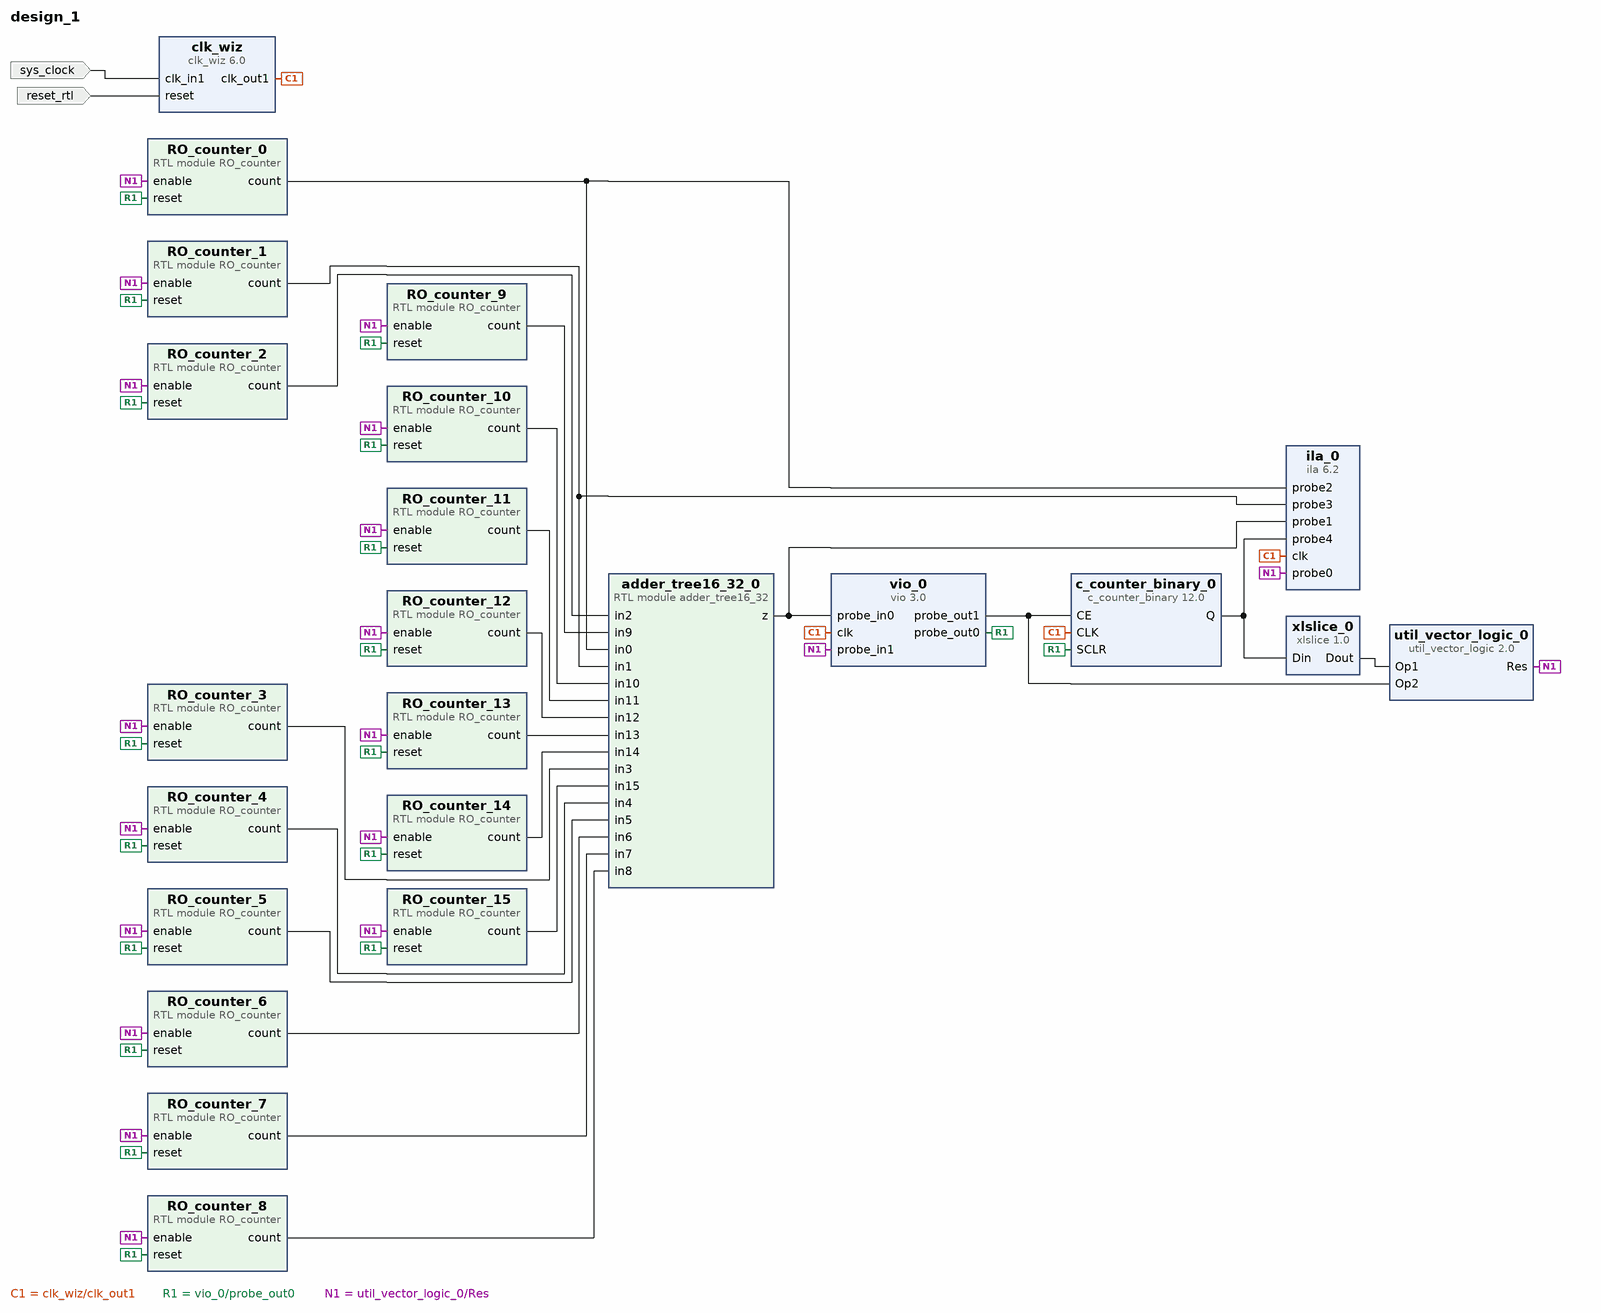
[diagram p0: block diagram of the top level]
# Vivado block design design_1, xc7z010clg400-1, Vivado 2020.1
create_bd_design design_1

create_bd_port -dir I -type clk sys_clock
set_property -dict {CONFIG.FREQ_HZ 125000000 CONFIG.PHASE 0.000} [get_bd_ports sys_clock]
create_bd_port -dir I -type rst reset_rtl
set_property -dict {CONFIG.POLARITY ACTIVE_HIGH} [get_bd_ports reset_rtl]

create_bd_cell -type ip -vlnv xilinx.com:ip:vio:3.0 vio_0
set_property -dict {CONFIG.C_NUM_PROBE_IN 2 CONFIG.C_NUM_PROBE_OUT 2} [get_bd_cells vio_0]
create_bd_cell -type ip -vlnv xilinx.com:ip:ila:6.2 ila_0
set_property -dict [list \
  CONFIG.ALL_PROBE_SAME_MU false \
  CONFIG.C_DATA_DEPTH 16384 \
  CONFIG.C_ENABLE_ILA_AXI_MON false \
  CONFIG.C_MONITOR_TYPE Native \
  CONFIG.C_NUM_OF_PROBES 5 \
  CONFIG.C_PROBE1_TYPE 1 \
  CONFIG.C_PROBE1_WIDTH 36 \
  CONFIG.C_PROBE2_TYPE 1 \
  CONFIG.C_PROBE2_WIDTH 32 \
  CONFIG.C_PROBE3_TYPE 1 \
  CONFIG.C_PROBE3_WIDTH 32 \
  CONFIG.C_PROBE4_WIDTH 16 \
] [get_bd_cells ila_0]
create_bd_cell -type ip -vlnv xilinx.com:ip:clk_wiz:6.0 clk_wiz
set_property -dict {CONFIG.CLK_IN1_BOARD_INTERFACE sys_clock CONFIG.USE_BOARD_FLOW true} [get_bd_cells clk_wiz]
create_bd_cell -type ip -vlnv xilinx.com:ip:c_counter_binary:12.0 c_counter_binary_0
set_property -dict {CONFIG.CE true CONFIG.SCLR true CONFIG.SSET false} [get_bd_cells c_counter_binary_0]
create_bd_cell -type ip -vlnv xilinx.com:ip:xlslice:1.0 xlslice_0
set_property -dict {CONFIG.DIN_FROM 15 CONFIG.DIN_TO 15 CONFIG.DIN_WIDTH 16 CONFIG.DOUT_WIDTH 1} [get_bd_cells xlslice_0]
create_bd_cell -type ip -vlnv xilinx.com:ip:util_vector_logic:2.0 util_vector_logic_0
set_property -dict {CONFIG.C_SIZE 1} [get_bd_cells util_vector_logic_0]
create_bd_cell -type module -reference adder_tree16_32 adder_tree16_32_0
create_bd_cell -type module -reference RO_counter RO_counter_0
create_bd_cell -type module -reference RO_counter RO_counter_1
create_bd_cell -type module -reference RO_counter RO_counter_10
create_bd_cell -type module -reference RO_counter RO_counter_11
create_bd_cell -type module -reference RO_counter RO_counter_12
create_bd_cell -type module -reference RO_counter RO_counter_13
create_bd_cell -type module -reference RO_counter RO_counter_14
create_bd_cell -type module -reference RO_counter RO_counter_15
create_bd_cell -type module -reference RO_counter RO_counter_2
create_bd_cell -type module -reference RO_counter RO_counter_3
create_bd_cell -type module -reference RO_counter RO_counter_4
create_bd_cell -type module -reference RO_counter RO_counter_5
create_bd_cell -type module -reference RO_counter RO_counter_6
create_bd_cell -type module -reference RO_counter RO_counter_7
create_bd_cell -type module -reference RO_counter RO_counter_8
create_bd_cell -type module -reference RO_counter RO_counter_9

# ---- connections ----

connect_bd_net -net ring_osc_top_0_monitor_count [get_bd_pins adder_tree16_32_0/z] [get_bd_pins ila_0/probe1] [get_bd_pins vio_0/probe_in0]
connect_bd_net [get_bd_pins clk_wiz/clk_out1] [get_bd_pins vio_0/clk] [get_bd_pins c_counter_binary_0/CLK] [get_bd_pins ila_0/clk]
connect_bd_net [get_bd_ports sys_clock] [get_bd_pins clk_wiz/clk_in1]
connect_bd_net [get_bd_ports reset_rtl] [get_bd_pins clk_wiz/reset]
connect_bd_net [get_bd_pins RO_counter_0/count] [get_bd_pins ila_0/probe2] [get_bd_pins adder_tree16_32_0/in0]
connect_bd_net [get_bd_pins RO_counter_1/count] [get_bd_pins ila_0/probe3] [get_bd_pins adder_tree16_32_0/in1]
connect_bd_net [get_bd_pins RO_counter_2/count] [get_bd_pins adder_tree16_32_0/in2]
connect_bd_net [get_bd_pins RO_counter_3/count] [get_bd_pins adder_tree16_32_0/in3]
connect_bd_net [get_bd_pins RO_counter_4/count] [get_bd_pins adder_tree16_32_0/in4]
connect_bd_net [get_bd_pins RO_counter_5/count] [get_bd_pins adder_tree16_32_0/in5]
connect_bd_net [get_bd_pins RO_counter_6/count] [get_bd_pins adder_tree16_32_0/in6]
connect_bd_net [get_bd_pins RO_counter_7/count] [get_bd_pins adder_tree16_32_0/in7]
connect_bd_net [get_bd_pins RO_counter_8/count] [get_bd_pins adder_tree16_32_0/in8]
connect_bd_net [get_bd_pins RO_counter_9/count] [get_bd_pins adder_tree16_32_0/in9]
connect_bd_net [get_bd_pins RO_counter_10/count] [get_bd_pins adder_tree16_32_0/in10]
connect_bd_net [get_bd_pins RO_counter_11/count] [get_bd_pins adder_tree16_32_0/in11]
connect_bd_net [get_bd_pins RO_counter_12/count] [get_bd_pins adder_tree16_32_0/in12]
connect_bd_net [get_bd_pins RO_counter_13/count] [get_bd_pins adder_tree16_32_0/in13]
connect_bd_net [get_bd_pins RO_counter_14/count] [get_bd_pins adder_tree16_32_0/in14]
connect_bd_net [get_bd_pins RO_counter_15/count] [get_bd_pins adder_tree16_32_0/in15]
connect_bd_net [get_bd_pins vio_0/probe_out0] \
  [get_bd_pins c_counter_binary_0/SCLR] [get_bd_pins RO_counter_0/reset] [get_bd_pins RO_counter_1/reset] \
  [get_bd_pins RO_counter_10/reset] [get_bd_pins RO_counter_11/reset] [get_bd_pins RO_counter_12/reset] \
  [get_bd_pins RO_counter_13/reset] [get_bd_pins RO_counter_14/reset] [get_bd_pins RO_counter_15/reset] \
  [get_bd_pins RO_counter_2/reset] [get_bd_pins RO_counter_3/reset] [get_bd_pins RO_counter_4/reset] \
  [get_bd_pins RO_counter_5/reset] [get_bd_pins RO_counter_6/reset] [get_bd_pins RO_counter_7/reset] \
  [get_bd_pins RO_counter_8/reset] [get_bd_pins RO_counter_9/reset]
connect_bd_net -net vio_0_probe_out1 [get_bd_pins util_vector_logic_0/Res] \
  [get_bd_pins ila_0/probe0] [get_bd_pins vio_0/probe_in1] [get_bd_pins RO_counter_0/enable] \
  [get_bd_pins RO_counter_1/enable] [get_bd_pins RO_counter_10/enable] [get_bd_pins RO_counter_11/enable] \
  [get_bd_pins RO_counter_12/enable] [get_bd_pins RO_counter_13/enable] [get_bd_pins RO_counter_14/enable] \
  [get_bd_pins RO_counter_15/enable] [get_bd_pins RO_counter_2/enable] [get_bd_pins RO_counter_3/enable] \
  [get_bd_pins RO_counter_4/enable] [get_bd_pins RO_counter_5/enable] [get_bd_pins RO_counter_6/enable] \
  [get_bd_pins RO_counter_7/enable] [get_bd_pins RO_counter_8/enable] [get_bd_pins RO_counter_9/enable]
connect_bd_net [get_bd_pins c_counter_binary_0/Q] [get_bd_pins xlslice_0/Din] [get_bd_pins ila_0/probe4]
connect_bd_net [get_bd_pins vio_0/probe_out1] [get_bd_pins c_counter_binary_0/CE] [get_bd_pins util_vector_logic_0/Op2]
connect_bd_net [get_bd_pins xlslice_0/Dout] [get_bd_pins util_vector_logic_0/Op1]

validate_bd_design
save_bd_design
